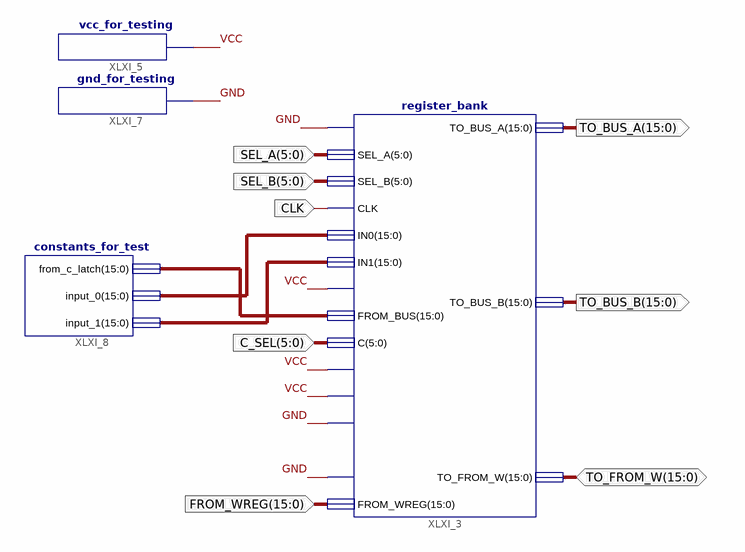
[diagram p0: schematic sheet 1]
// Xilinx ISE schematic test.sch (artix7) as structural Verilog: 4 symbols, 8 ports
module test (
  input  [5:0] SEL_A,
  input  [5:0] SEL_B,
  input  [15:0] FROM_WREG,
  input  [5:0] C_SEL,
  input  CLK,
  inout  [15:0] TO_FROM_W,
  output [15:0] TO_BUS_A,
  output [15:0] TO_BUS_B
);

  wire GND, VCC;
  wire [15:0] XLXN_14, XLXN_15, XLXN_16;

  register_bank XLXI_3 (
    .CLR(GND), .SEL_A(SEL_A), .SEL_B(SEL_B), .CLK(CLK), .IN0(XLXN_15), .IN1(XLXN_16), .CE_DIN(VCC),
    .FROM_BUS(XLXN_14), .C(C_SEL), .ENABLE_DEMUX_C(VCC), .INPUT_DEMUX(VCC), .MR(GND), .MW(GND),
    .TO_FROM_W(TO_FROM_W), .TO_BUS_A(TO_BUS_A), .TO_BUS_B(TO_BUS_B), .FROM_WREG(FROM_WREG));
  vcc_for_testing XLXI_5 (.vcc(VCC));
  gnd_for_testing XLXI_7 (.gnd(GND));
  constants_for_test XLXI_8 (.from_c_latch(XLXN_14), .input_0(XLXN_15), .input_1(XLXN_16));
endmodule
